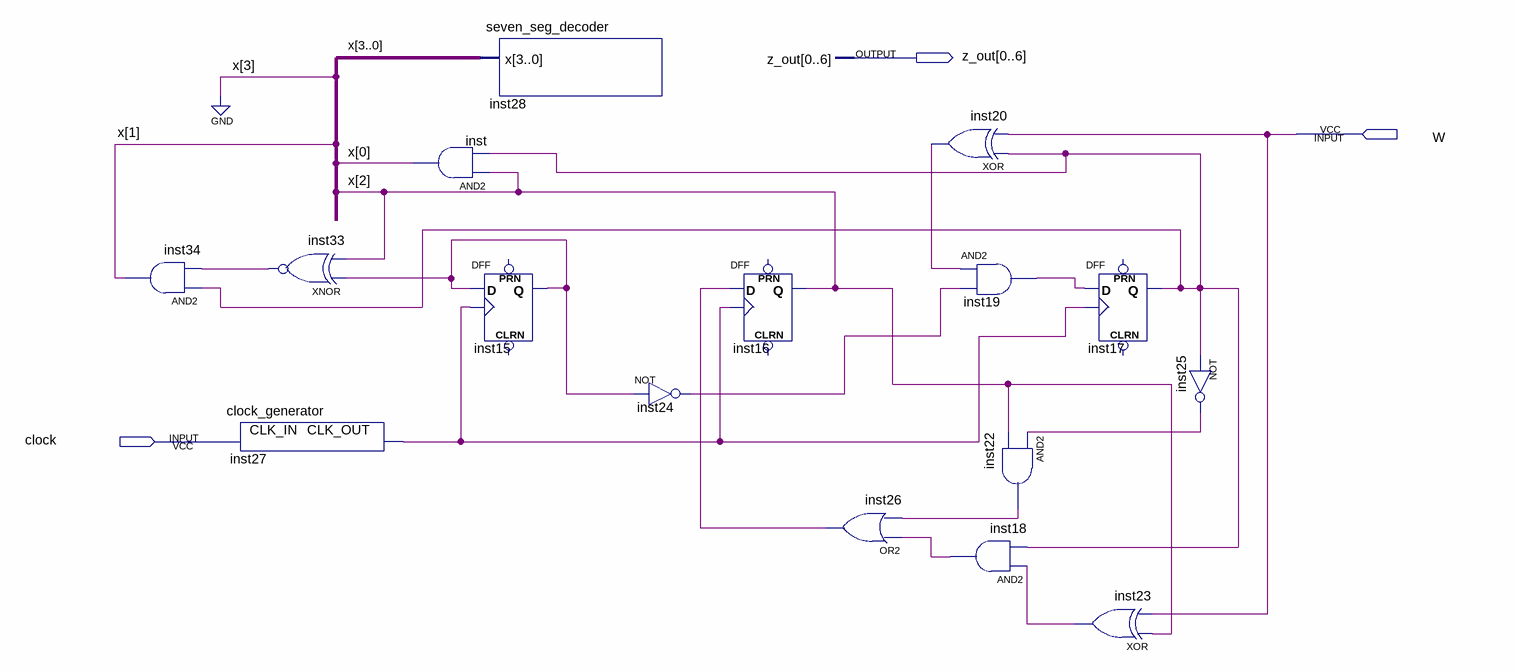
[diagram p0: schematic sheet]
// Quartus schematic dumb_stuff.bdf as structural Verilog: 16 symbols, 3 pins
module dumb_stuff (
  input  W,
  input  clock,
  output [0:6] z_out
);

  wire inst15_q, inst17_q, inst18_out, inst19_out, inst20_out, inst22_out, inst23_out, inst24_out,
       inst25_out, inst26_out, inst27_clk_out, inst33_out;
  wire [2:0] x;

  and inst34 (x[1], inst17_q, inst33_out);
  clock_generator inst27 (.CLK_IN(clock), .CLK_OUT(inst27_clk_out));
  xnor inst33 (inst33_out, inst15_q, x[2]);
  seven_seg_decoder inst28 (.x({1'b0, x}), .z_out(z_out));
  and inst (x[0], x[2], inst17_q);
  DFF inst15 (.CLK(inst27_clk_out), .D(inst15_q), .Q(inst15_q));  // open: CLRN, PRN
  not inst24 (inst24_out, inst15_q);
  DFF inst16 (.CLK(inst27_clk_out), .D(inst26_out), .Q(x[2]));  // open: CLRN, PRN
  or inst26 (inst26_out, inst18_out, inst22_out);
  xor inst20 (inst20_out, inst17_q, W);
  and inst19 (inst19_out, inst20_out, inst24_out);
  and inst22 (inst22_out, inst25_out, x[2]);
  and inst18 (inst18_out, inst23_out, inst17_q);
  DFF inst17 (.CLK(inst27_clk_out), .D(inst19_out), .Q(inst17_q));  // open: CLRN, PRN
  xor inst23 (inst23_out, x[2], W);
  not inst25 (inst25_out, inst17_q);
endmodule
